# EAGLE schematic Power_Supply_Circuit (EAGLE 9.3.2)
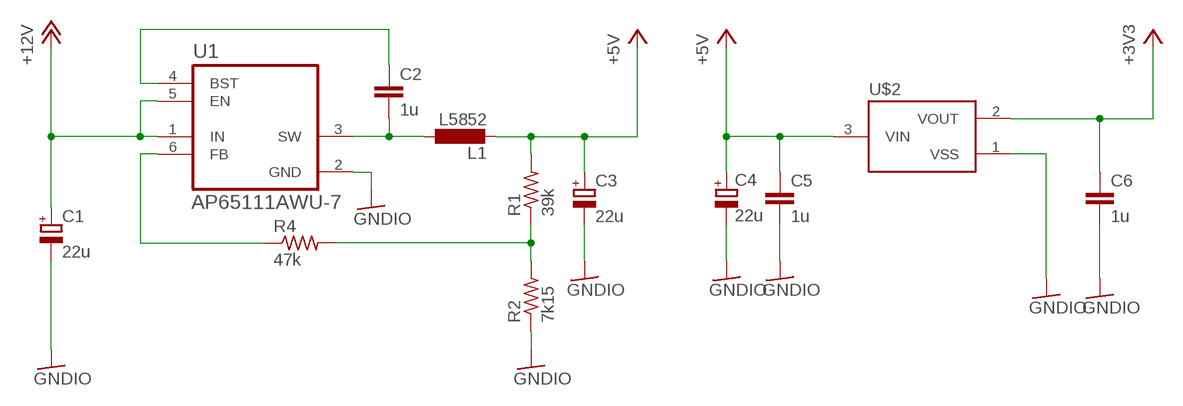
[diagram p0: schematic, sheet 1]

## Parts
C1  22u  CPOL-EUE2-5  [E2-5]
C2  1u  C-EUC0603  [C0603]
C3  22u  CPOL-EUE2-5  [E2-5]
C4  22u  CPOL-EUE3.5-8  [E3,5-8]
C5  1u  C-EUC0603  [C0603]
C6  1u  C-EUC0603  [C0603]
L1  L5852  [L5852]
R1  39k  R-US_R0603  [R0603]
R2  7k15  R-US_R0603  [R0603]
R4  47k  R-US_R0603  [R0603]
U1  AP65111AWU-7  [SOT95P280X100-6N]
U$2  AP2120  [SOT95P240X110-3]

## Nets
+3V3: C6.1 U$2.2(VOUT)
+5V: C3.+ C4.+ C5.1 L1.P$2 R1.2 U$2.3(VIN)
+12V: C1.+ U1.1(IN) U1.5(EN)
GNDIO: C1.- C3.- C4.- C5.2 C6.2 R2.1 U1.2(GND) U$2.1(VSS)
N$1: C2.2 L1.P$1 U1.3(SW)
N$2: C2.1 U1.4(BST)
N$3: R1.1 R2.2 R4.2
N$5: R4.1 U1.6(FB)

## Library data of the parts
C1 C3 C4 = rcl:CPOL-EU: POLARIZED CAPACITOR, European symbol; SPICEPREFIX: C
C2 C5 C6 = rcl:C-EU: CAPACITOR, European symbol; SPICEPREFIX: C
L1 = l_ysk:L5852
R1 R2 R4 = rcl:R-US_: RESISTOR, American symbol; SPICEPREFIX: R
U1 = AP65111AWU-7:AP65111AWU-7: None; DESCRIPTION: Dcdc Conv Hv Buck Tsot26 t&r 3k; DIGI-KEY_PART_NUMBER: AP65111AWU-7DICT-ND; DIGI-KEY_PURCHASE_URL: https://www.digikey.jp/product-detail/en/diodes-incorporated/AP65111AWU-7/AP65111AWU-7DICT-ND/7652826?utm_source=snapeda&utm_medium=aggregator&utm_campaign=symbol; MF: Diodes Inc.; MP: AP65111AWU-7; PACKAGE: TSOT-23-6 Diodes Inc.
U$2 = torex:AP2120